# Altium project SRNDBadge.PrjPCB
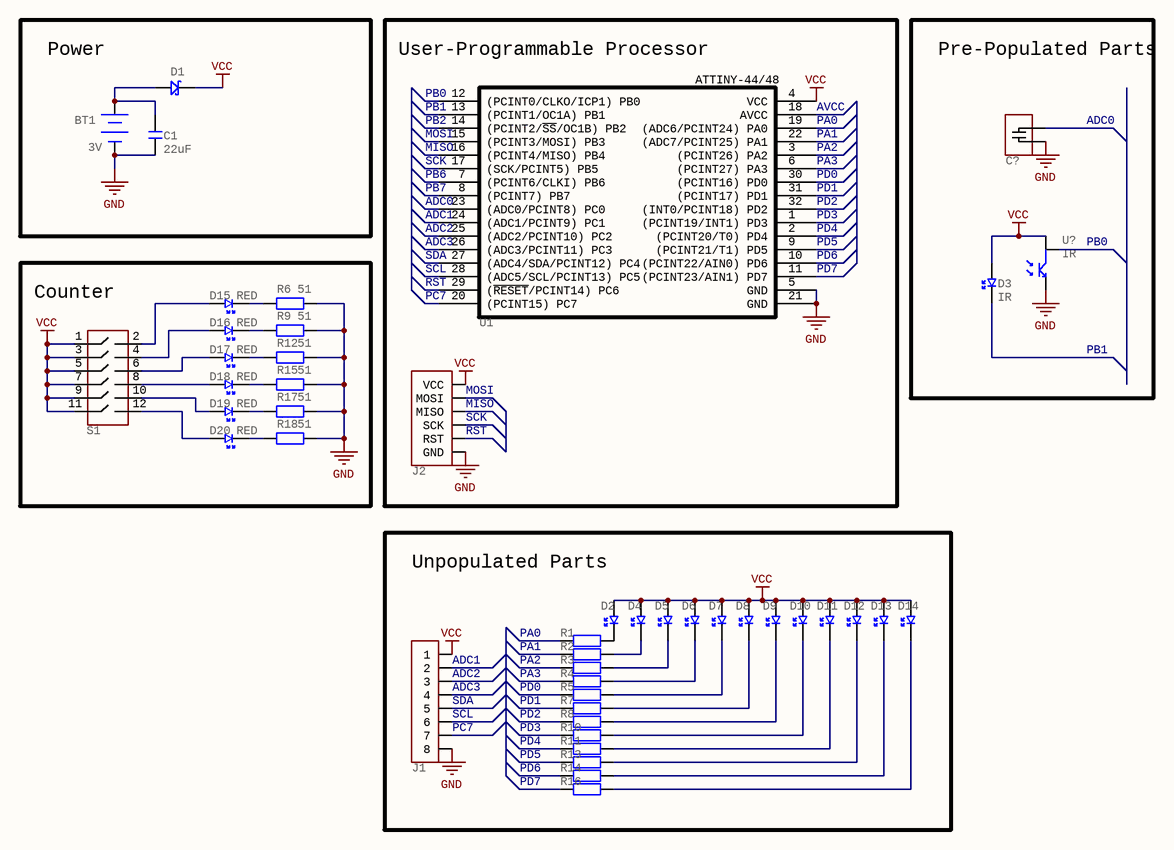
[diagram p0: SRNDBadge.SchDoc]
1 sheet, 46 parts. Net scope: global (net labels, ports and power ports of the same name join across sheets).
Board file: SRNDBadge.PcbDoc

## Sheet SRNDBadge.SchDoc: SRND Badge Addon
size Letter; Organization: Altium Limited; Address1: L3, 12a Rodborough Rd; Address2: Frenchs Forest; Address3: NSW; Address4: Australia 2086; Revision: 1.0; SheetNumber: 1; SheetTotal: 1

### Parts
BT1  Voltage: 3V  (hidden comment: *)
C1  value 22uF  [Cap Radial Small]
C?  CAP TOUCH SENSOR  (value not drawn)
D1  (no value)  [Diode]
D2  DIODE LED  [Diode]  (value not drawn)
D3  Color: IR  [Diode]  (hidden comment: DIODE LED)
D4  DIODE LED  [Diode]  (value not drawn)
D5  DIODE LED  [Diode]  (value not drawn)
D6  DIODE LED  [Diode]  (value not drawn)
D7  DIODE LED  [Diode]  (value not drawn)
D8  DIODE LED  [Diode]  (value not drawn)
D9  DIODE LED  [Diode]  (value not drawn)
D10  DIODE LED  [Diode]  (value not drawn)
D11  DIODE LED  [Diode]  (value not drawn)
D12  DIODE LED  [Diode]  (value not drawn)
D13  DIODE LED  [Diode]  (value not drawn)
D14  DIODE LED  [Diode]  (value not drawn)
D15  Color: RED  [Diode]  (hidden comment: DIODE LED)
D16  Color: RED  [Diode]  (hidden comment: DIODE LED)
D17  Color: RED  [Diode]  (hidden comment: DIODE LED)
D18  Color: RED  [Diode]  (hidden comment: DIODE LED)
D19  Color: RED  [Diode]  (hidden comment: DIODE LED)
D20  Color: RED  [Diode]  (hidden comment: DIODE LED)
J1  CONN 8-PIN  (value not drawn)
J2  CONN ISP 6-PIN  (value not drawn)
R1  RES  [RES]  (value not drawn)
R2  RES  [RES]  (value not drawn)
R3  RES  [RES]  (value not drawn)
R4  RES  [RES]  (value not drawn)
R5  RES  [RES]  (value not drawn)
R6  value 51  [RES]  (hidden comment: RES)
R7  RES  [RES]  (value not drawn)
R8  RES  [RES]  (value not drawn)
R9  value 51  [RES]  (hidden comment: RES)
R10  RES  [RES]  (value not drawn)
R11  RES  [RES]  (value not drawn)
R12  value 51  [RES]  (hidden comment: RES)
R13  RES  [RES]  (value not drawn)
R14  RES  [RES]  (value not drawn)
R15  value 51  [RES]  (hidden comment: RES)
R16  RES  [RES]  (value not drawn)
R17  value 51  [RES]  (hidden comment: RES)
R18  value 51  [RES]  (hidden comment: RES)
S1  DIP 6-PIN  (value not drawn)
U1  ATTINY48/88  (value not drawn)
U?  Color: IR  (hidden comment: RECEIVER)

### Blocks framed on the sheet
Power: BT1 C1 D1
User-Programmable Processor: J2 U1
Pre-Populated Parts: C? D3 U?
Counter: D15-D20 R6 R9 R12 R15 R17 R18 S1
Unpopulated Parts: D2 D4-D14 J1 R1-R5 R7 R8 R10 R11 R13 R14 R16

### Nets
GND: BT1.2 C1.1 C?.2 J1.8 J2.6(GND) R6.2 R9.2 R12.2 R15.2 R17.2 R18.2 U1.5(GND) U1.21(GND) U?.2(GND)
VCC: D1.K D2.A D3.A D4.A D5.A D6.A D7.A D8.A D9.A D10.A D11.A D12.A D13.A D14.A J1.1 J2.2(VCC) S1.1 S1.3 S1.5 S1.7 S1.9 S1.11 U1.4(VCC) U?.3(VCC)
ADC0: C?.1 U1.23((ADC0/PCINT8)_PC0)
ADC1: J1.2 U1.24((ADC1/PCINT9)_PC1)
ADC2: J1.3 U1.25((ADC2/PCINT10)_PC2)
ADC3: J1.4 U1.26((ADC3/PCINT11)_PC3)
AVCC: U1.18(AVCC)
MISO: J2.1(MISO) U1.16((PCINT4/MISO)_PB4)
MOSI: J2.4(MOSI) U1.15((PCINT3/MOSI)_PB3)
PA0: R1.1 U1.19((ADC6/PCINT24)_PA0)
PA1: R2.1 U1.22((ADC7/PCINT25)_PA1)
PA2: R3.1 U1.3((PCINT26)_PA2)
PA3: R4.1 U1.6((PCINT27)_PA3)
PB0: U1.12((PCINT0/CLKO/ICP1)_PB0) U?.1(OUT)
PB1: D3.K U1.13((PCINT1/OC1A)_PB1)
PB2: U1.14((PCINT2/~{SS}/OC1B)_PB2)
PB6: U1.7((PCINT6/CLKI)_PB6)
PB7: U1.8((PCINT7)_PB7)
PC7: J1.7 U1.20((PCINT15)_PC7)
PD0: R5.1 U1.30((PCINT16)_PD0)
PD1: R7.1 U1.31((PCINT17)_PD1)
PD2: R8.1 U1.32((INT0/PCINT18)_PD2)
PD3: R10.1 U1.1((PCINT19/INT1)_PD3)
PD4: R11.1 U1.2((PCINT20/T0)_PD4)
PD5: R13.1 U1.9((PCINT21/T1)_PD5)
PD6: R14.1 U1.10((PCINT22/AIN0)_PD6)
PD7: R16.1 U1.11((PCINT23/AIN1)_PD7)
RST: J2.5(RST) U1.29((~{RESET}/PCINT14)_PC6)
SCK: J2.3(SCK) U1.17((SCK/PCINT5)_PB5)
SCL: J1.6 U1.28((ADC5/SCL/PCINT13)_PC5)
SDA: J1.5 U1.27((ADC4/SDA/PCINT12)_PC4)
NetBT1_1: BT1.1 C1.2 D1.A
NetD2_K: D2.K R1.2
NetD4_K: D4.K R2.2
NetD5_K: D5.K R3.2
NetD6_K: D6.K R4.2
NetD7_K: D7.K R5.2
NetD8_K: D8.K R7.2
NetD9_K: D9.K R8.2
NetD10_K: D10.K R10.2
NetD11_K: D11.K R11.2
NetD12_K: D12.K R13.2
NetD13_K: D13.K R14.2
NetD14_K: D14.K R16.2
NetD15_A: D15.A S1.2
NetD15_K: D15.K R6.1
NetD16_A: D16.A S1.4
NetD16_K: D16.K R9.1
NetD17_A: D17.A S1.6
NetD17_K: D17.K R12.1
NetD18_A: D18.A S1.8
NetD18_K: D18.K R15.1
NetD19_A: D19.A S1.10
NetD19_K: D19.K R17.1
NetD20_A: D20.A S1.12
NetD20_K: D20.K R18.1

### Notes on the sheet
- Title:
- Number:
- Version:
- File:
- Tyler Menezes
- https://tyler.vc/
- Sheet
- of
- Date:
- Time:
- x@tyler.vc
- (in symbol ATTINY48/88) ATTINY-44/48

### Library data of the parts
BT1 = BAT: Battery
C1 = CAP: Capacitor
C? = PAD 2
D1 = DIODE SCHOTTKY: Schottky Diode; PN: 11DQ06
D2-D20 = DIODE LED: LED
  D2 D4-D14: Color: ?
R1-R18 = RES: Resistor
U? = RECEIVER: IR/Visible Receiver